# EAGLE design LoRaBoard (EAGLE 9.6.2)
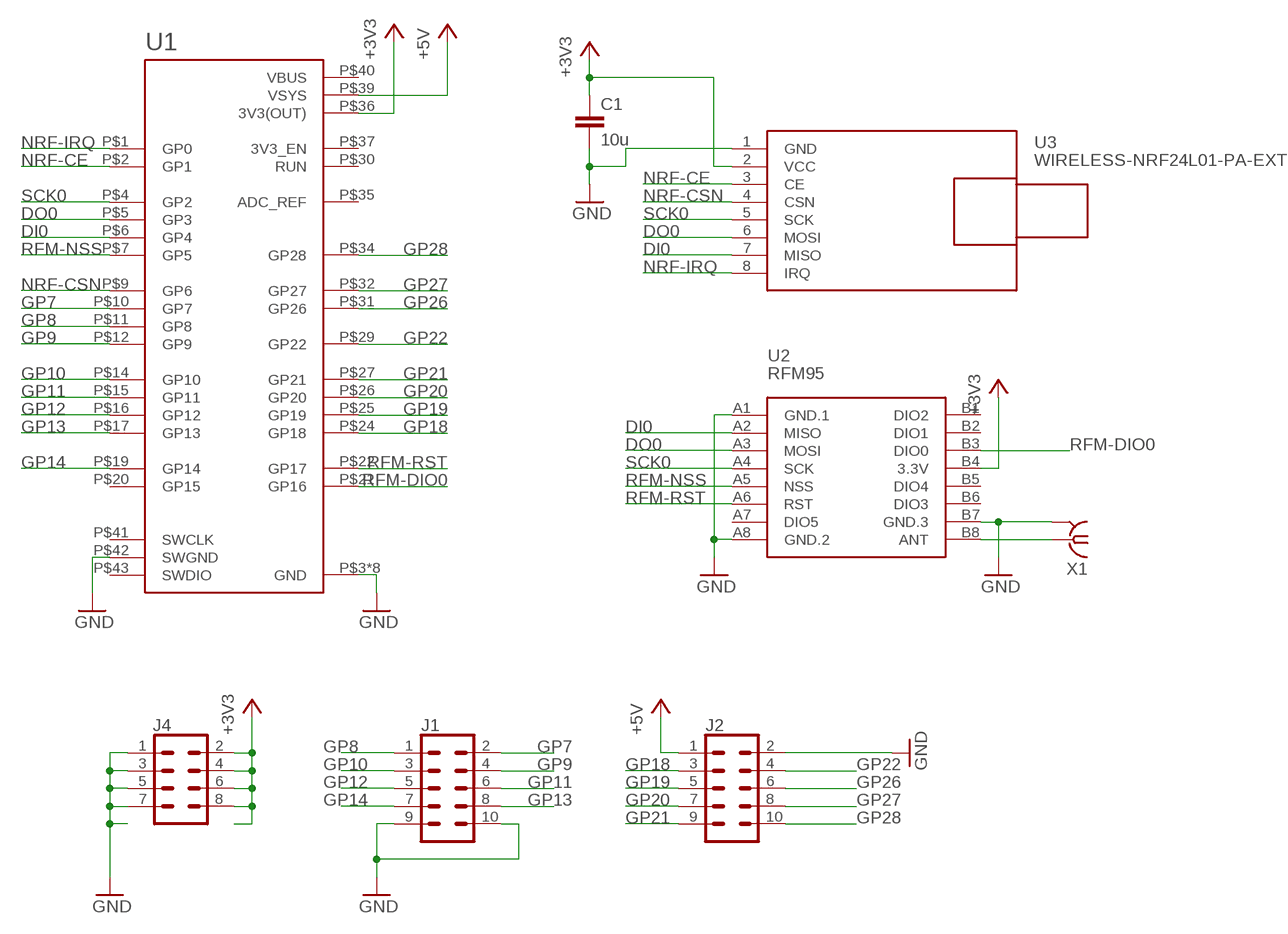
[diagram p0: schematic, sheet 1]

## Parts
C1  10u  C-EUC0805  [C0805]
J1  CONN_05X2PTH  [2X5]
J2  CONN_05X2PTH  [2X5]
J4  CONN_04X2  [2X4]
U1  RASPBERRY_PICOSMD  [PICO-PKG-SMD]
U2  RFM95  WIRELESS-LORA-RFM95W#SMD  [WIRELESS-LORA-RFM95W#SMD]
U3  WIRELESS-NRF24L01-PA-EXT  [WIRELESS-NRF24L01-PA-EXT]
X1  SMA-142-0701-801/806  [J502-ND-142-0701-801/806]

## Nets
+3V3: C1.1 J4.2 J4.4 J4.6 J4.8 U1.P$36(3V3(OUT)) U2.B4(3.3V) U3.2(VCC)
+5V: J2.1 U1.P$39(VSYS)
DI0: U1.P$6(GP4) U2.A2(MISO) U3.7(MISO)
DO0: U1.P$5(GP3) U2.A3(MOSI) U3.6(MOSI)
GND: C1.2 J1.9 J1.10 J2.2 J4.1 J4.3 J4.5 J4.7 U1.P$3(GND) U1.P$8(GND) U1.P$13(GND) U1.P$18(GND) U1.P$23(GND) U1.P$28(GND) U1.P$33(GND) U1.P$38(GND) U1.P$42(SWGND) U2.A1(GND.1) U2.A8(GND.2) U2.B7(GND.3) U3.1(GND) X1.G@1 X1.G@2 X1.G@3 X1.G@4
GP7: J1.2 U1.P$10(GP7)
GP8: J1.1 U1.P$11(GP8)
GP9: J1.4 U1.P$12(GP9)
GP10: J1.3 U1.P$14(GP10)
GP11: J1.6 U1.P$15(GP11)
GP12: J1.5 U1.P$16(GP12)
GP13: J1.8 U1.P$17(GP13)
GP14: J1.7 U1.P$19(GP14)
GP18: J2.3 U1.P$24(GP18)
GP19: J2.5 U1.P$25(GP19)
GP20: J2.7 U1.P$26(GP20)
GP21: J2.9 U1.P$27(GP21)
GP22: J2.4 U1.P$29(GP22)
GP26: J2.6 U1.P$31(GP26)
GP27: J2.8 U1.P$32(GP27)
GP28: J2.10 U1.P$34(GP28)
N$1: U2.B8(ANT) X1.1
NRF-CE: U1.P$2(GP1) U3.3(CE)
NRF-CSN: U1.P$9(GP6) U3.4(CSN)
NRF-IRQ: U1.P$1(GP0) U3.8(IRQ)
RFM-DIO0: U1.P$21(GP16) U2.B3(DIO0)
RFM-NSS: U1.P$7(GP5) U2.A5(NSS)
RFM-RST: U1.P$22(GP17) U2.A6(RST)
SCK0: U1.P$4(GP2) U2.A4(SCK) U3.5(SCK)
Unconnected: U1.P$20(GP15) U1.P$30(RUN) U1.P$35(ADC_REF) U1.P$37(3V3_EN) U1.P$41(SWCLK) U1.P$43(SWDIO) U2.A7(DIO5) U2.B1(DIO2) U2.B2(DIO1) U2.B5(DIO4) U2.B6(DIO3)

## Power pins joined to a net without a drawn wire
VBUS: U1.P$40(VBUS)

## Library data of the parts
C1 = rcl:C-EU: CAPACITOR, European symbol; SPICEPREFIX: C
J1 J2 = SparkFun-Connectors:CONN_05X2: Multi connection point. Often used as Generic Header-pin footprint for 0.1 inch spaced/style header connections For AVR SPI programming port, see special device with nice symbol: "AVR_SPI_PROG_5x2.dev" You can populate with any combo of single row headers, but if you'd like an exact match, check these: 2x5 AVR ICSP Male Header <https://www.sparkfun.com/products/778> (PRT-00778) 2x5 Pin Shrouded Header <https://www.sparkfun.com/products/8506> (PRT-08506) On any of the 0.1 inch spaced packages, you can populate with these: Break Away Headers - Straight <https://www.sparkfun.com/products/116> (PRT-00116) Break Away Male Headers - Right Angle <https://www.sparkfun.com/products/553> (PRT-00553) Female Headers <https://www.sparkfun.com/products/115> (PRT-00115) Break Away Headers - Machine Pin <https://www.sparkfun.com/products/117> (PRT-00117) Break Away Female Headers - Swiss Machine Pin <https://www.sparkfun.com/products/743> (PRT-00743) Special note: the shrouded connector mates well with our 5x2 ribbon cables: 2x5 Pin IDC Ribbon Cable <https://www.sparkfun.com/products/8535> (PRT-08535); PROD_ID: CONN-08499; SF_ID: PRT-0778
J4 = SparkFun-Connectors:CONN_04X2: Multi connection point. Often used as Generic Header-pin footprint for 0.1 inch spaced/style header connections On any of the 0.1 inch spaced packages, you can populate with these: Break Away Headers - Straight <https://www.sparkfun.com/products/116> (PRT-00116) Break Away Male Headers - Right Angle <https://www.sparkfun.com/products/553> (PRT-00553) Female Headers <https://www.sparkfun.com/products/115> (PRT-00115) Break Away Headers - Machine Pin <https://www.sparkfun.com/products/117> (PRT-00117) Break Away Female Headers - Swiss Machine Pin <https://www.sparkfun.com/products/743> (PRT-00743)
U1 = RpiPico:RASPBERRY_PICO: Raspberry Pi Pico
U2 = diy-modules:WIRELESS-LORA-RFM95W: 868/915 MHz LoRa Radio Transceiver Module based on SX1276 chip Click here to find device on ebay.com <http://www.ebay.com/sch/RFM95W+transceiver>
U3 = diy-modules:WIRELESS-NRF24L01-PA-EXT: 2.4 GHz Wireless Module based on NRF24L01 chip with preamplifier and external antenna Click here to find device on ebay.com <http://www.ebay.com/sch/nrf24l01+pa+lna+sma>
X1 = con-coax:SMA-: SMA 50 Ohm End Launch Jack Receptacle - Round Contact Johnson Components Source: www.johnsoncomponents.com .. J502-ND.pdf; MF: JOHNSON COMPONENTS; MPN: 142-0701-801; OC_FARNELL: 1608592; OC_NEWARK: 90F2624

## Board
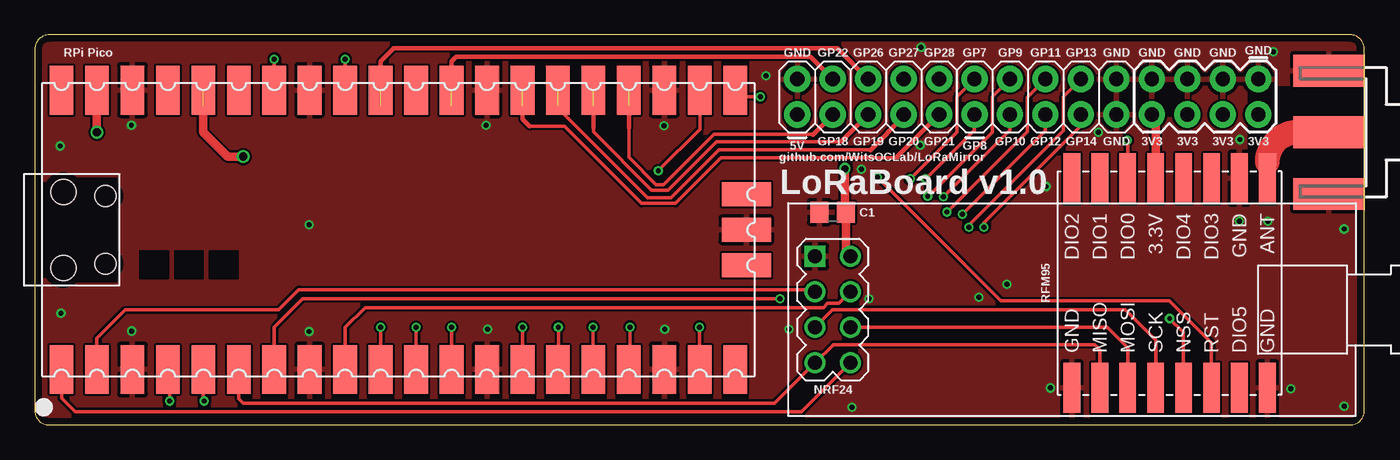
[diagram p1: board, top side]
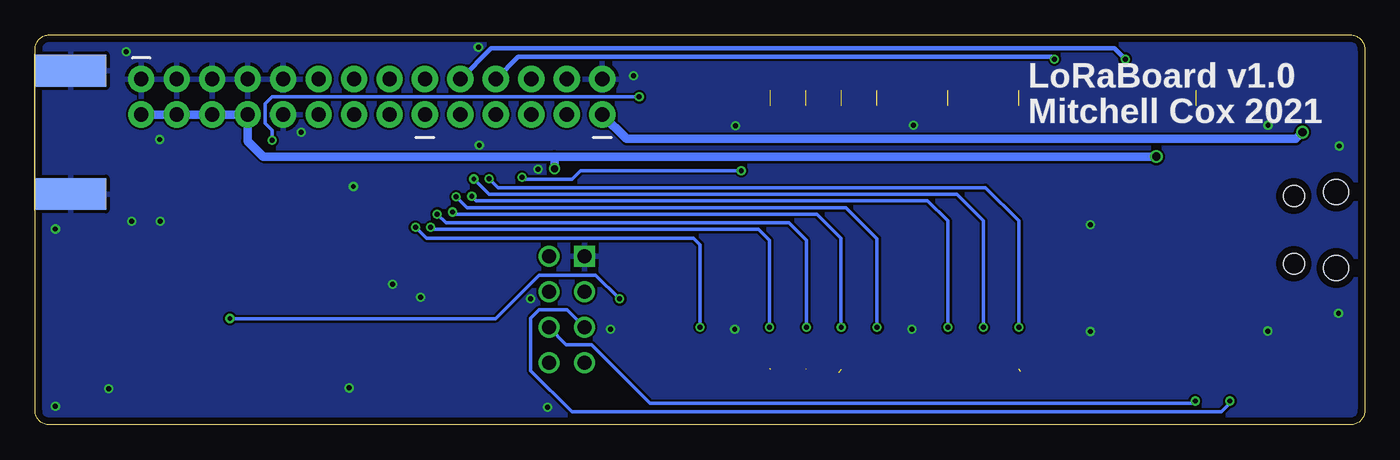
[diagram p2: board, bottom side, seen from below]

Size 95.25 x 27.93 mm. Coordinates in mm from the lower left corner, seen from the top.
Outline: 0,26.93 0,1 arc90 1,0 94.23,0 arc90 95.23,1 95.23,26.93 arc90 94.23,27.93 1,27.93 arc90 0,26.93
Copper layers (1*16): Top 0.035mm / dielectric 1.6mm / Bottom 0.035mm
Design rules "Elecrow_2-layer_PCB_eagle_rule": minimum track width 6mil, minimum drill 12mil, track to track 6mil, track to pad 6mil, pad to pad 6mil, via to via 8mil, smd to smd 0mil, copper to edge 20mil, drill to drill 10mil, minimum pad ring 6mil, minimum via ring 6mil, stop-mask expansion 0mil, vias tented up to drill 100mil, thermal gap 10mil
tRestrict: area 87,15.9 to 95.2,24.1

### Footprints (pad centres in the part's own frame; a part is rotated, then mirrored left to right if it is on the bottom)
C0805 = smd 1.3 x 1.5: 1 -0.95,0; 2 0.95,0
2X5 = drill 1.016 pad 1.88: 1 0,0; 2 0,2.54; 3 2.54,0; 4 2.54,2.54; 5 5.08,0; 6 5.08,2.54; 7 7.62,0; 8 7.62,2.54; 9 10.16,0; 10 10.16,2.54
2X4 = drill 1.016 pad 1.88: 1 -3.81,-1.27; 2 -3.81,1.27; 3 -1.27,-1.27; 4 -1.27,1.27; 5 1.27,-1.27; 6 1.27,1.27; 7 3.81,-1.27; 8 3.81,1.27
PICO-PKG-SMD = smd 3.5 x 1.7: P$1 -10,24.13; P$2 -10,21.59; P$3 -10,19.05; P$4 -10,16.51; P$5 -10,13.97; P$6 -10,11.43; P$7 -10,8.89; P$8 -10,6.35; P$9 -10,3.81; P$10 -10,1.27; P$11 -10,-1.27; P$12 -10,-3.81; P$13 -10,-6.35; P$14 -10,-8.89; P$15 -10,-11.43; P$16 -10,-13.97; P$17 -10,-16.51; P$18 -10,-19.05; P$19 -10,-21.59; P$20 -10,-24.13; P$21 10,-24.13; P$22 10,-21.59; P$23 10,-19.05; P$24 10,-16.51; P$25 10,-13.97; P$26 10,-11.43; P$27 10,-8.89; P$28 10,-6.35; P$29 10,-3.81; P$30 10,-1.27; P$31 10,1.27; P$32 10,3.81; P$33 10,6.35; P$34 10,8.89; P$35 10,11.43; P$36 10,13.97; P$37 10,16.51; P$38 10,19.05; P$39 10,21.59; P$40 10,24.13 | smd 1.7 x 3.5: P$41 -2.54,-24.925; P$42 0,-24.925; P$43 2.54,-24.925 | hole 1.8: -2.725,24; 2.725,24 | hole 1.5: -2.425,20.97; 2.425,20.97
WIRELESS-LORA-RFM95W#SMD = smd 3.6 x 1.2: A1 -7.5,7; A2 -7.5,5; A3 -7.5,3; A4 -7.5,1; A5 -7.5,-1; A6 -7.5,-3; A7 -7.5,-5; A8 -7.5,-7; B1 7.5,7; B2 7.5,5; B3 7.5,3; B4 7.5,1; B5 7.5,-1; B6 7.5,-3; B7 7.5,-5; B8 7.5,-7
WIRELESS-NRF24L01-PA-EXT = drill 1 square: 1 -18.415,3.81 | drill 1: 2 -15.875,3.81; 3 -18.415,1.27; 4 -15.875,1.27; 5 -18.415,-1.27; 6 -15.875,-1.27; 7 -18.415,-3.81; 8 -15.875,-3.81
J502-ND-142-0701-801/806 = smd 5.08 x 2.286: 1 2.565,0; G@1 2.565,4.42; G@2 2.565,-4.42 | smd 5.08 x 2.286 bottom: G@3 2.565,4.42; G@4 2.565,-4.42

### Placement (x,y rotation side)
C1  57.15,15.24 180 top
J1  67.31,22.23 0 top
J2  54.61,22.23 0 top
J4  83.82,23.5 180 top
U1  26.04,13.97 90 top
U2  81.28,10.16 90 top
U3  74.3,8.26 0 top
X1  95.25,20.95 180 top

### Tracks (layer width: path | path; a pad name or v marks a point on that pad's centre or on a via)
+3V3  (via drill 0.5, 0.6)  (1 unrouted)
  Top 0.61: v14.92,19.21 13.81,19.21 12.06,20.95 12.06,22.86 | U3.2 58.1,12.38 C1.1 58.1,15.18 58.03,15.25 v58.03,18.36 | U2.B4 80.28,21.95 J4.8
  Bottom 0.61: J4.2 J4.4 J4.6 J4.8 80.01,20.32 78.9,19.21 58.03,19.21 | 58.03,19.21 v14.92,19.21 | v58.03,18.36 58.03,19.21
+5V  (via drill 0.6)
  Top 0.61: v4.45,20.95 U1.P$39
  Bottom 0.61: J2.1 52.86,20.48 4.92,20.48 v4.45,20.95
DI0
  Top 0.254: U2.A2 76.28,5.4 75.92,5.76 57.19,5.76 U3.7 52.99,1.56 14.94,1.56 14.61,1.89 U1.P$6
DO0  (via drill 0.35)
  Top 0.254: U2.A3 78.28,5.54 76.83,6.99 U3.6 | v12.13,1.71 12.06,1.78 U1.P$5
  Bottom 0.254: U3.6 57.19,5.76 55.38,5.76 51.18,1.56 12.29,1.56 v12.13,1.71
GND  (via drill 0.35)
  other vias: 59.74,9.02 45.12,6.85 58.52,1.27 72.75,2.65 89.97,2.6 86.3,20.44 86.28,14.59 88.31,14.59 76.17,20.96 72.44,17.08 69.64,10.07 67.61,9.14 59.21,18.32 63.41,20.03 52.37,25.01 45.06,21.43 32.32,21.47 6.92,21.47 6.95,6.72 19.64,6.69 1.87,7.99 1.82,19.97 19.65,14.34 54.01,6.85 32.42,6.85 93.78,1.33 93.78,14.03 88.7,26.73 63.48,27.04
  pour Top: 0,27.94 95.25,27.94 95.25,1 arc-90 94.25,0 1,0 arc-90 0,1
  pour Bottom: 0,29.21 0,-1.27 95.25,-1.27 95.25,29.21
GP7  (via drill 0.35)  (1 unrouted)
  Top 0.254: J1.2 66.04,23.5 66.04,20.95 v62.71,17.62 | v24.77,6.99 24.77,4.45 24.13,3.81 24.61,3.81
  Bottom 0.254: v62.71,17.62 62.08,17 27.16,17 24.77,14.61 v24.77,6.99
GP8  (via drill 0.35)
  Top 0.254: v63.81,17.61 67.31,21.11 J1.1 | v27.3,6.99 U1.P$11
  Bottom 0.254: v27.3,6.99 27.3,14.61 29.22,16.52 62.72,16.52 v63.81,17.61
GP9  (via drill 0.35)
  Top 0.254: J1.4 68.58,23.5 68.58,20.95 63.98,16.35 v63.95,16.38 | v29.84,6.99 U1.P$12
  Bottom 0.254: v63.95,16.38 v63.94,16.38 63.63,16.07 31.31,16.07 29.84,14.61 v29.84,6.99
GP10  (via drill 0.35)
  Top 0.254: J1.3 69.85,21.11 v65.08,16.34 | v34.92,6.99 U1.P$14
  Bottom 0.254: v34.92,6.99 34.92,13.34 37.15,15.56 64.3,15.56 v65.08,16.34
GP11  (via drill 0.35)  (1 unrouted)
  Top 0.254: J1.6 71.1,23.47 71.1,21 v65.34,15.25 | v37.49,7 37.49,3.58 37.65,3.42 37.65,3.79
  Bottom 0.254: v37.49,7 37.49,13.36 39.21,15.08 65.34,15.08 v65.34,15.25
GP12  (via drill 0.35)  (1 unrouted)
  Top 0.254: J1.5 72.39,21.05 v66.43,15.09 | v39.98,7 39.98,3.99
  Bottom 0.254: v66.43,15.09 65.81,14.47 41.23,14.47 39.98,13.22 v39.98,7
GP13  (via drill 0.35)  (1 unrouted)
  Top 0.254: J1.8 73.66,23.5 73.66,21.08 66.9,14.31 v66.9,14.16 | v42.63,7 42.63,4.05
  Bottom 0.254: v42.63,7 42.63,13.22 43.41,14 66.74,14 v66.9,14.16
GP14  (via drill 0.35)
  Top 0.254: J1.7 74.93,21.41 67.99,14.47 v67.99,14.16 | 47.62,6.98 v47.61,7 47.61,3.99 U1.P$19
  Bottom 0.254: v67.99,14.16 67.21,13.38 48.07,13.38 47.61,12.91 v47.61,7
GP18  (1 unrouted)
  Top 0.254: 55.72,20.8 55.7,20.82 48.66,20.82 45.04,17.21 44.49,17.21 42.55,19.16 42.55,21.27
  Top 0.305: J2.3 55.72,20.8 | 42.55,21.27 42.55,22.86
GP19  (1 unrouted)
  Top 0.254: 57.78,20.32 57.84,20.26 48.83,20.26 45.37,16.8 44.18,16.8 40.01,20.98 40.01,21.27
  Top 0.305: J2.5 57.78,20.32 | 40.01,21.27 40.01,22.86
GP20  (1 unrouted)
  Top 0.254: 59.84,19.68 59.83,19.7 48.99,19.7 45.57,16.27 43.87,16.27 37.47,22.68 37.47,22.86
  Top 0.305: J2.7 62.23,22.07 59.84,19.68
GP21  (1 unrouted)
  Top 0.254: 35.44,21.38 37.93,21.38 43.44,15.87 45.9,15.87 49.16,19.14 61.81,19.14 61.75,19.2
  Top 0.305: J2.9 61.75,19.2 | 35.44,21.38 34.92,21.89 34.92,22.86
GP22  (1 unrouted)
  Top 0.305: J2.4 55.56,26.35 30.16,26.35 29.84,26.04 29.84,22.86
GP26  (1 unrouted)
  Top 0.305: J2.6 57.48,26.98 25.7,26.98 24.77,26.04 24.77,22.86
GP27  (via drill 0.35)
  Top 0.254: v22.23,26.19 U1.P$32
  Bottom 0.305: J2.8 60.64,26.35 22.39,26.35 v22.23,26.19
GP28  (via drill 0.35)
  Top 0.254: v17.14,26.19 U1.P$34
  Bottom 0.305: J2.10 62.56,26.98 17.93,26.98 v17.14,26.19
N$1
  Top 1.27: 90.82,20.95 X1.1 90.43,20.95 | 88.28,18.41 U2.B8 88.28,18.82
  Top 1.74: 90.43,20.95 arc45 88.9,20.32 arc45 88.28,18.82
NRF-CE
  Top 0.254: U1.P$2 4.45,6.21 6.48,8.24 17.44,8.24 18.89,9.69 55.71,9.69 U3.3
NRF-CSN
  Top 0.254: U3.4 57.61,8.71 56.78,8.71 56.47,8.4 23.64,8.4 22.23,6.99 U1.P$9
NRF-IRQ
  Top 0.254: U3.8 54.91,0.93 2.88,0.93 1.91,1.91 U1.P$1
RFM-DIO0  (via drill 0.35)
  Top 0.254: U2.B3 78.28,20.36 | v51.96,23.49 50.64,23.49
  Top 0.305: 78.28,20.36 v78.25,20.38 | 50.64,23.49 U1.P$21
  Bottom 0.254: v78.25,20.38 78.25,21.1 78.74,21.59 78.74,23.01 78.25,23.49 v51.96,23.49
RFM-NSS  (via drill 0.35)
  Top 0.254: U2.A5 82.28,6.62 v81.28,7.62 | v53.36,9.02 19.18,9.02 17.14,6.99 U1.P$7
  Bottom 0.254: v81.28,7.62 62.23,7.62 59.12,10.73 55.07,10.73 v53.36,9.02
RFM-RST  (via drill 0.35)
  Top 0.254: U1.P$22 47.62,21.18 v44.65,18.2 | v60.36,17.74 69.21,8.89 81.28,8.89 84.28,5.89 U2.A6
  Bottom 0.254: v60.36,17.74 60.21,17.58 56.78,17.58 56.16,18.2 v44.65,18.2
SCK0  (via drill 0.35)
  Top 0.254: U2.A4 80.28,6.08 78.11,8.24 57.14,8.24 U3.5 | v9.65,1.71 9.65,3.85 U1.P$4
  Bottom 0.254: U3.5 57.14,8.24 59.12,8.24 59.74,7.62 59.74,3.89 56.78,0.93 10.27,0.93 9.65,1.56 v9.65,1.71

### Text on the board
tPlace: github.com/WitsOCLab/LoRaMirror | LoRaBoard v1.0
bPlace: LoRaBoard v1.0 | Mitchell Cox 2021
tNames: RPi Pico | GND | GP22 | GP26 | GP27 | GP28 | GP7 | GP9 | GP11 | GP13 | GND | GND | GND | GND | GND | 5V | GP18 | GP19 | GP20 | GP21 | GP8 | GP10 | GP12 | GP14 | GND | 3V3 | 3V3 | 3V3 | 3V3 | RFM95 | NRF24